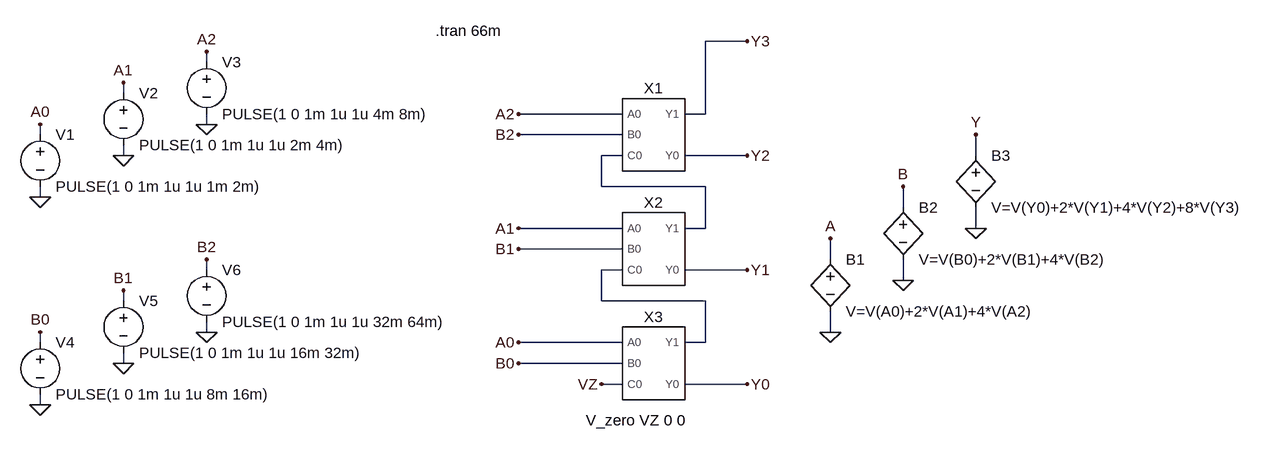
[diagram p0: schematic Fig_9-16_3-Bit-Adder_Analog.asc]
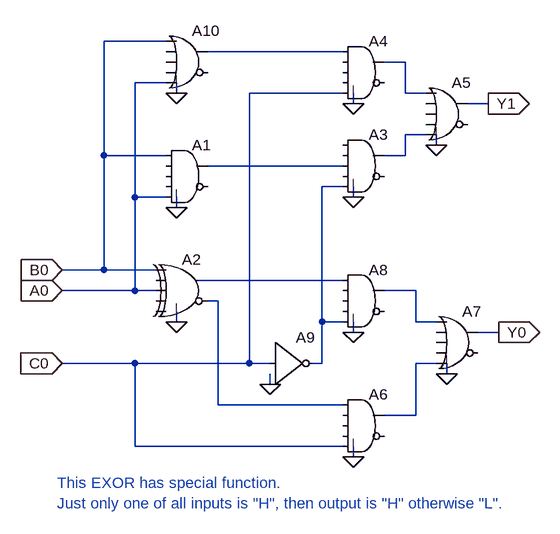
[diagram p1: sub-circuit full_adder.asc]
Fig_9-16_3-Bit-Adder_Analog.asc, the LTspice schematic file:
Version 4
SHEET 1 1076 868
WIRE 192 -384 128 -384
WIRE -640 -352 -640 -368
WIRE -768 -304 -768 -320
WIRE 0 -272 -160 -272
WIRE 128 -272 128 -384
WIRE 128 -272 96 -272
WIRE -640 -256 -640 -272
WIRE -896 -240 -896 -256
WIRE 0 -240 -160 -240
WIRE -768 -208 -768 -224
WIRE 0 -208 -32 -208
WIRE 192 -208 96 -208
WIRE 544 -208 544 -240
WIRE -32 -160 -32 -208
WIRE 128 -160 -32 -160
WIRE -896 -144 -896 -160
WIRE 432 -128 432 -160
WIRE 0 -96 -160 -96
WIRE 128 -96 128 -160
WIRE 128 -96 96 -96
WIRE 544 -96 544 -128
WIRE 0 -64 -160 -64
WIRE 320 -48 320 -80
WIRE -640 -32 -640 -48
WIRE 0 -32 -32 -32
WIRE 192 -32 96 -32
WIRE 432 -16 432 -48
WIRE -768 16 -768 0
WIRE -32 16 -32 -32
WIRE 128 16 -32 16
WIRE -640 64 -640 48
WIRE 320 64 320 32
WIRE -896 80 -896 64
WIRE 0 80 -160 80
WIRE 128 80 128 16
WIRE 128 80 96 80
WIRE -768 112 -768 96
WIRE 0 112 -160 112
WIRE 0 144 -32 144
WIRE 192 144 96 144
WIRE -896 176 -896 160
FLAG -160 80 A0
FLAG -160 -96 A1
FLAG -160 -272 A2
FLAG -160 112 B0
FLAG -160 -64 B1
FLAG -160 -240 B2
FLAG 192 144 Y0
FLAG 192 -32 Y1
FLAG 192 -208 Y2
FLAG 192 -384 Y3
FLAG -896 -256 A0
FLAG -768 -320 A1
FLAG -640 -368 A2
FLAG -896 -144 0
FLAG -768 -208 0
FLAG -640 -256 0
FLAG -32 144 VZ
FLAG -896 64 B0
FLAG -768 0 B1
FLAG -640 -48 B2
FLAG -896 176 0
FLAG -768 112 0
FLAG -640 64 0
FLAG 320 64 0
FLAG 432 -16 0
FLAG 320 -80 A
FLAG 432 -160 B
FLAG 544 -96 0
FLAG 544 -240 Y
SYMBOL voltage -896 -256 R0
WINDOW 123 0 0 Left 2
WINDOW 39 0 0 Left 2
SYMATTR InstName V1
SYMATTR Value PULSE(1 0 1m 1u 1u 1m 2m)
SYMBOL voltage -768 -320 R0
SYMATTR InstName V2
SYMATTR Value PULSE(1 0 1m 1u 1u 2m 4m)
SYMBOL voltage -640 -368 R0
SYMATTR InstName V3
SYMATTR Value PULSE(1 0 1m 1u 1u 4m 8m)
SYMBOL voltage -896 64 R0
WINDOW 123 0 0 Left 2
WINDOW 39 0 0 Left 2
SYMATTR InstName V4
SYMATTR Value PULSE(1 0 1m 1u 1u 8m 16m)
SYMBOL voltage -768 0 R0
SYMATTR InstName V5
SYMATTR Value PULSE(1 0 1m 1u 1u 16m 32m)
SYMBOL voltage -640 -48 R0
SYMATTR InstName V6
SYMATTR Value PULSE(1 0 1m 1u 1u 32m 64m)
SYMBOL bv 320 -64 R0
SYMATTR InstName B1
SYMATTR Value V=V(A0)+2*V(A1)+4*V(A2)
SYMBOL bv 432 -144 R0
SYMATTR InstName B2
SYMATTR Value V=V(B0)+2*V(B1)+4*V(B2)
SYMBOL bv 544 -224 R0
SYMATTR InstName B3
SYMATTR Value V=V(Y0)+2*V(Y1)+4*V(Y2)+8*V(Y3)
SYMBOL full_adder 48 -240 R0
SYMATTR InstName X1
SYMBOL full_adder 48 -64 R0
SYMATTR InstName X2
SYMBOL full_adder 48 112 R0
SYMATTR InstName X3
TEXT -56 200 Left 2 !V_zero VZ 0 0
TEXT -288 -400 Left 2 !.tran 66m

full_adder.asc, the sub-circuit schematic file:
Version 4
SHEET 1 1000 936
WIRE 32 -304 -64 -304
WIRE 304 -288 96 -288
WIRE 400 -272 368 -272
WIRE 32 -240 -16 -240
WIRE 48 -224 48 -240
WIRE 304 -224 160 -224
WIRE 400 -224 400 -272
WIRE 432 -224 400 -224
WIRE 320 -208 320 -224
WIRE 528 -208 496 -208
WIRE 432 -160 400 -160
WIRE 448 -144 448 -160
WIRE -64 -128 -64 -304
WIRE 32 -128 -64 -128
WIRE 400 -128 400 -160
WIRE 400 -128 368 -128
WIRE 304 -112 96 -112
WIRE 304 -80 272 -80
WIRE -16 -64 -16 -240
WIRE 32 -64 -16 -64
WIRE 320 -64 320 -80
WIRE 48 -48 48 -64
WIRE -64 48 -64 -128
WIRE -64 48 -128 48
WIRE 16 48 -64 48
WIRE 304 64 80 64
WIRE -16 80 -16 -64
WIRE -16 80 -128 80
WIRE 16 80 -16 80
WIRE 416 80 368 80
WIRE 112 96 96 96
WIRE 48 128 48 112
WIRE 272 128 272 -80
WIRE 304 128 272 128
WIRE 416 128 416 80
WIRE 448 128 416 128
WIRE 320 144 320 128
WIRE 544 144 512 144
WIRE -16 192 -128 192
WIRE 160 192 160 -224
WIRE 160 192 -16 192
WIRE 192 192 160 192
WIRE 272 192 272 128
WIRE 272 192 256 192
WIRE 448 192 416 192
WIRE 464 208 464 192
WIRE 192 224 192 208
WIRE 112 256 112 96
WIRE 304 256 112 256
WIRE 416 272 416 192
WIRE 416 272 368 272
WIRE -16 320 -16 192
WIRE 304 320 -16 320
WIRE 320 336 320 320
FLAG 48 -48 0
FLAG 48 128 0
FLAG -128 80 A0
IOPIN -128 80 In
FLAG -128 48 B0
IOPIN -128 48 In
FLAG 544 144 Y0
IOPIN 544 144 Out
FLAG 528 -208 Y1
IOPIN 528 -208 Out
FLAG -128 192 C0
IOPIN -128 192 In
FLAG 320 -64 0
FLAG 320 -208 0
FLAG 448 -144 0
FLAG 320 336 0
FLAG 464 208 0
FLAG 320 144 0
FLAG 192 224 0
FLAG 48 -224 0
SYMBOL Digital\\and 64 -160 R0
SYMATTR InstName A1
SYMBOL Digital\\xor 64 16 R0
SYMATTR InstName A2
SYMBOL Digital\\and 336 -176 R0
SYMATTR InstName A3
SYMBOL Digital\\and 336 -320 R0
SYMATTR InstName A4
SYMBOL Digital\\or 464 -256 R0
SYMATTR InstName A5
SYMBOL Digital\\and 336 224 R0
SYMATTR InstName A6
SYMBOL Digital\\or 480 96 R0
SYMATTR InstName A7
SYMBOL Digital\\and 336 32 R0
SYMATTR InstName A8
SYMBOL Digital\\inv 192 128 R0
SYMATTR InstName A9
SYMBOL Digital\\or 64 -336 R0
SYMATTR InstName A10
TEXT -136 376 Left 2 ;This EXOR has special function.\nJust only one of all inputs is "H", then output is "H" otherwise "L".

The netlist it stands for:
* Fig_9-16_3-Bit-Adder_Analog.asc
V1 A0 0 PULSE(1 0 1m 1u 1u 1m 2m)
V2 A1 0 PULSE(1 0 1m 1u 1u 2m 4m)
V3 A2 0 PULSE(1 0 1m 1u 1u 4m 8m)
V4 B0 0 PULSE(1 0 1m 1u 1u 8m 16m)
V5 B1 0 PULSE(1 0 1m 1u 1u 16m 32m)
V6 B2 0 PULSE(1 0 1m 1u 1u 32m 64m)
B1 A 0 V=V(A0)+2*V(A1)+4*V(A2)
B2 B 0 V=V(B0)+2*V(B1)+4*V(B2)
B3 Y 0 V=V(Y0)+2*V(Y1)+4*V(Y2)+8*V(Y3)
XX1 A2 B2 N001 Y2 Y3 full_adder
XX2 A1 B1 N002 Y1 N001 full_adder
XX3 A0 B0 VZ Y0 N002 full_adder

* block symbol definitions
.subckt full_adder A0 B0 C0 Y0 Y1
A1 B0 0 0 0 A0 0 N004 0 AND
A2 B0 0 A0 0 0 N008 N006 0 XOR
A3 0 0 N004 0 N005 0 N003 0 AND
A4 N001 0 0 0 C0 0 N002 0 AND
A5 N002 0 0 0 N003 0 Y1 0 OR
A6 N008 0 0 0 C0 0 N009 0 AND
A7 N007 0 0 0 N009 0 Y0 0 OR
A8 N006 0 0 0 N005 0 N007 0 AND
A9 C0 0 0 0 0 N005 0 0 BUF
A10 B0 0 0 0 A0 0 N001 0 OR
* This EXOR has special function.
* Just only one of all inputs is "H", then output is "H" otherwise "L".
.ends full_adder

V_zero VZ 0 0
.tran 66m
.backanno
.end